# Altium schematic sheet Diagram.SchDoc
size A4; SheetNumber: 1; SheetTotal: 5
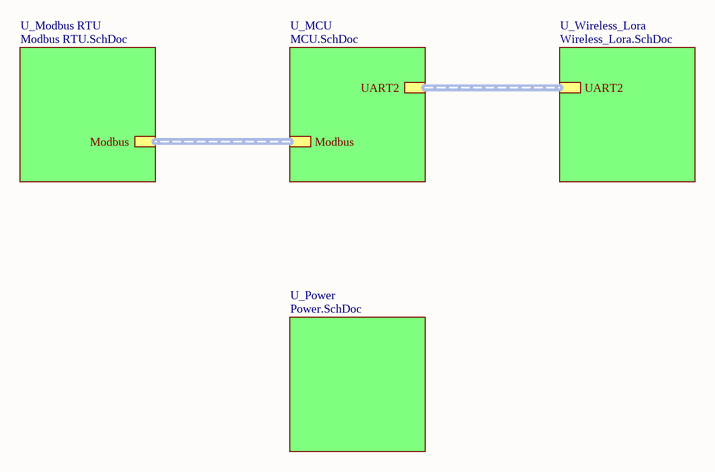
[diagram p0: Diagram.SchDoc]

## Sub-sheets
U_MCU = MCU.SchDoc: Modbus (harness Modbus), UART2 (harness UART2)
U_Modbus RTU = Modbus RTU.SchDoc: Modbus (harness Modbus)
U_Power = Power.SchDoc: no entries
U_Wireless_Lora = Wireless_Lora.SchDoc: UART2 (harness UART2)

## Buses and harness runs
harness sheet U_MCU/Modbus = sheet U_Modbus RTU/Modbus
harness sheet U_MCU/UART2 = sheet U_Wireless_Lora/UART2

## Notes on the sheet
- Title
- Size:
- Date:
- A3
- Number:
- Time:
- Revision:
- Sheet
- of
- NICHIETSUVN.COM <http://NICHIETSUVN.COM>
- R&D
- File: